# Altium schematic sheet Sheet4.SchDoc
size A4
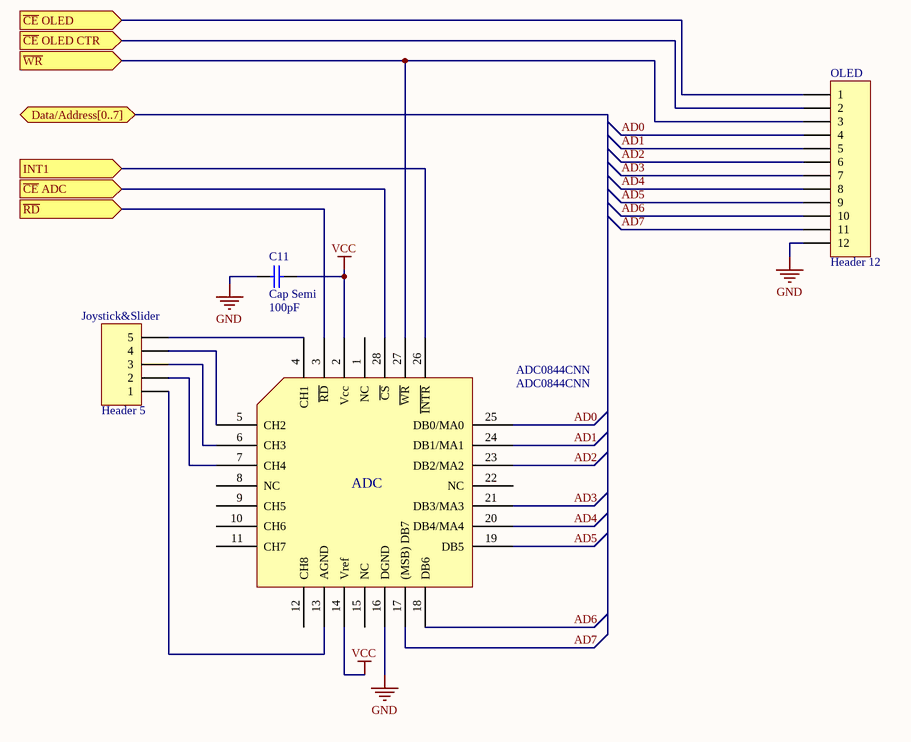
[diagram p0: Sheet4.SchDoc]

## Parts
ADC0844CNN  ADC0844CNN  [ADC0844CNN PLCC 28-PIN]
C11  Cap Semi  value 100pF  [C1210]
Joystick&Slider  Header 5  [HDR1X5]
OLED  Header 12  [HDR1X12]

## Ports
Data/Address[0..7] (bidir), INT1 (in), ~{CE} ADC (in), ~{CE} OLED (in), ~{CE} OLED CTR (in), ~{RD} (in), ~{WR} (in)

## Nets
GND: ADC0844CNN.16(DGND) C11.2 OLED.12
VCC: ADC0844CNN.2(Vcc) ADC0844CNN.14(Vref) C11.1
AD0: ADC0844CNN.25(DB0/MA0) OLED.4
AD1: ADC0844CNN.24(DB1/MA1) OLED.5
AD2: ADC0844CNN.23(DB2/MA2) OLED.6
AD3: ADC0844CNN.21(DB3/MA3) OLED.7
AD4: ADC0844CNN.20(DB4/MA4) OLED.8
AD5: ADC0844CNN.19(DB5) OLED.9
AD6: ADC0844CNN.18(DB6) OLED.10
AD7: ADC0844CNN.17((MSB)_DB7) OLED.11
~{CE} ADC: ADC0844CNN.28(~{CS}) ; port ~{CE} ADC
~{CE} OLED: OLED.1 ; port ~{CE} OLED
~{CE} OLED CTR: OLED.2 ; port ~{CE} OLED CTR
INT1: ADC0844CNN.26(~{INTR}) ; port INT1
~{RD}: ADC0844CNN.3(~{RD}) ; port ~{RD}
~{WR}: ADC0844CNN.27(~{WR}) OLED.3 ; port ~{WR}
NetADC0844CNN_4: ADC0844CNN.4(CH1) Joystick&Slider.5
NetADC0844CNN_5: ADC0844CNN.5(CH2) Joystick&Slider.4
NetADC0844CNN_6: ADC0844CNN.6(CH3) Joystick&Slider.3
NetADC0844CNN_7: ADC0844CNN.7(CH4) Joystick&Slider.2
NetADC0844CNN_13: ADC0844CNN.13(AGND) Joystick&Slider.1

Not connected (* = marked no-connect by the designer): ADC0844CNN 1(NC) 8(NC) 9(CH5) 10(CH6) 11(CH7) 12(CH8) 15(NC) 22(NC)

## Notes on the sheet
- (in symbol ADC0844CNN) ADC

## Library data of the parts
ADC0844CNN = ADC0844CNN: ADC - Analogue to Digital Converter
C11 = Cap Semi: Capacitor (Semiconductor SIM Model); Published: 8-Jun-2000; LatestRevisionDate: 29-May-2009; LatestRevisionNote: IPC-7351 Footprint Added.; PackageReference: C1206; Publisher: Altium Limited; PackageDescription: Chip Capacitor
Joystick&Slider = Header 5: Header, 5-Pin; LatestRevisionDate: 17-Jul-2002; LatestRevisionNote: Re-released for DXP Platform.; Publisher: Altium Limited
OLED = Header 12: Header, 12-Pin; LatestRevisionDate: 17-Jul-2002; LatestRevisionNote: Re-released for DXP Platform.; Publisher: Altium Limited